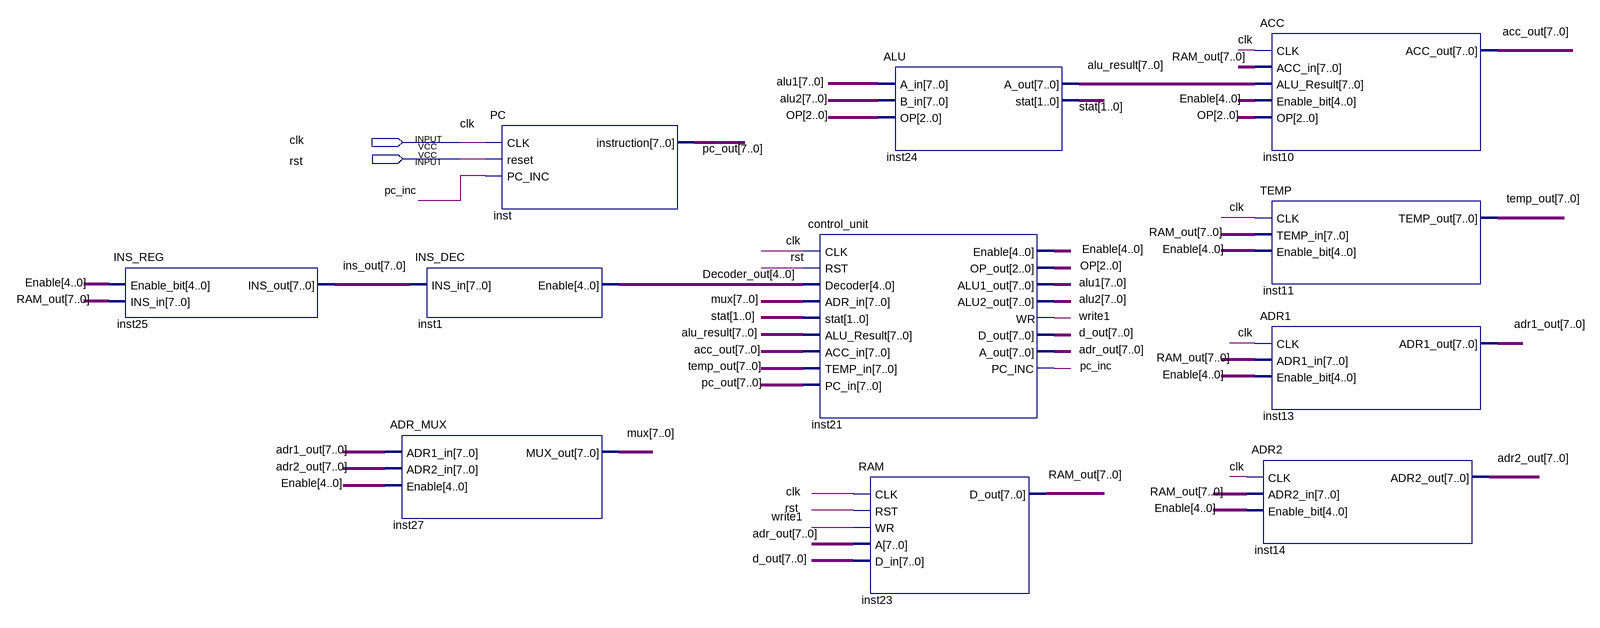
[diagram p0: schematic sheet]
// Quartus schematic design.bdf as structural Verilog: 11 symbols, 2 pins
module \design  (
  input  clk,
  input  rst
);

  wire pc_inc, write1;
  wire [1:0] stat;
  wire [2:0] OP;
  wire [4:0] Decoder_out, Enable;
  wire [7:0] acc_out, adr1_out, adr2_out, adr_out, alu1, alu2, alu_result, d_out, ins_out, mux, pc_out,
       RAM_out, temp_out;

  INS_REG inst25 (.Enable_bit(Enable), .INS_in(RAM_out), .INS_out(ins_out));
  INS_DEC inst1 (.INS_in(ins_out), .Enable(Decoder_out));
  ADR_MUX inst27 (.ADR1_in(adr1_out), .ADR2_in(adr2_out), .Enable(Enable), .MUX_out(mux));
  PC inst (.CLK(clk), .reset(rst), .PC_INC(pc_inc), .instruction(pc_out));
  control_unit inst21 (
    .CLK(clk), .RST(rst), .Decoder(Decoder_out), .ADR_in(mux), .stat(stat), .ALU_Result(alu_result),
    .ACC_in(acc_out), .TEMP_in(temp_out), .PC_in(pc_out), .Enable(Enable), .OP_out(OP), .ALU1_out(alu1),
    .ALU2_out(alu2), .WR(write1), .D_out(d_out), .A_out(adr_out), .PC_INC(pc_inc));
  ALU inst24 (.A_in(alu1), .B_in(alu2), .OP(OP), .A_out(alu_result), .stat(stat));
  RAM inst23 (.CLK(clk), .RST(rst), .WR(write1), .A(adr_out), .D_in(d_out), .D_out(RAM_out));
  ACC inst10 (.CLK(clk), .ACC_in(RAM_out), .ALU_Result(alu_result), .Enable_bit(Enable), .OP(OP), .ACC_out(acc_out));
  TEMP inst11 (.CLK(clk), .TEMP_in(RAM_out), .Enable_bit(Enable), .TEMP_out(temp_out));
  ADR1 inst13 (.CLK(clk), .ADR1_in(RAM_out), .Enable_bit(Enable), .ADR1_out(adr1_out));
  ADR2 inst14 (.CLK(clk), .ADR2_in(RAM_out), .Enable_bit(Enable), .ADR2_out(adr2_out));
endmodule
